# Altium schematic sheet Decawave.SchDoc
size A4
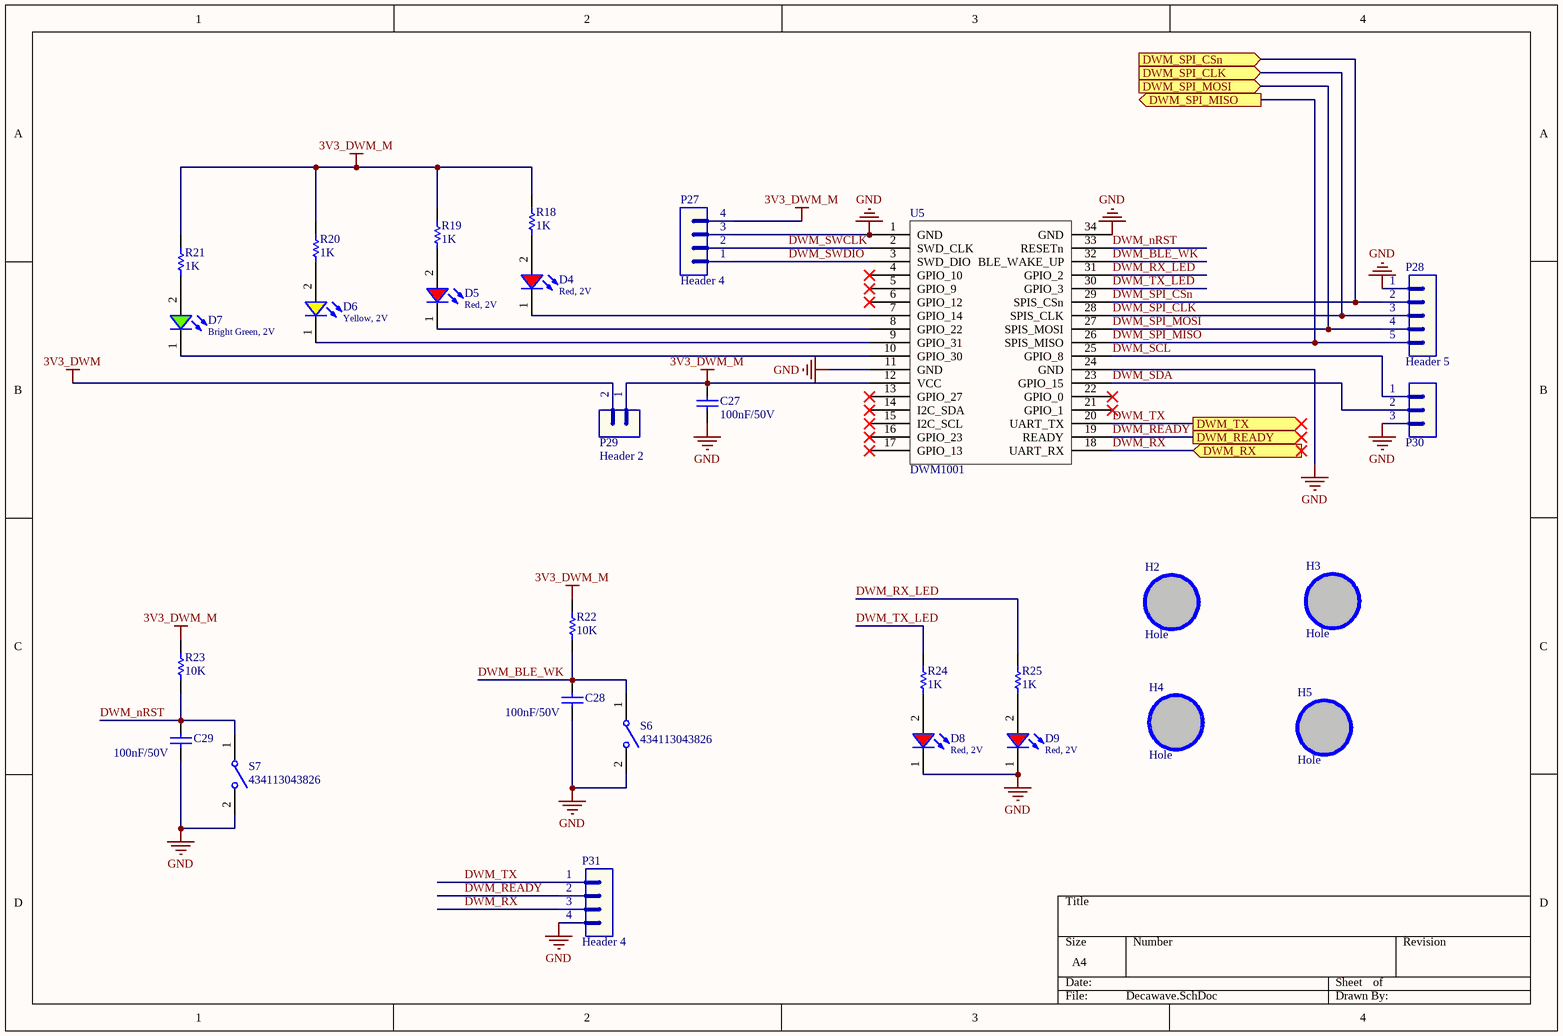
[diagram p0: Decawave.SchDoc]

## Parts
C27  value 100nF/50V  [CAP-SM-0805]  (hidden comment: Cap-100nF-50V-0805)
C28  value 100nF/50V  [CAP-SM-0805]  (hidden comment: Cap-100nF-50V-0805)
C29  value 100nF/50V  [CAP-SM-0805]  (hidden comment: Cap-100nF-50V-0805)
D4  Red, 2V  [WL-SMCW_0805]
D5  Red, 2V  [WL-SMCW_0805]
D6  Yellow, 2V  [WL-SMCW_0805]
D7  Bright Green, 2V  [WL-SMCW_0805]
D8  Red, 2V  [WL-SMCW_0805]
D9  Red, 2V  [WL-SMCW_0805]
H2  Hole  [LO KHOAN 3MM]
H3  Hole  [LO KHOAN 3MM]
H4  Hole  [LO KHOAN 3MM]
H5  Hole  [LO KHOAN 3MM]
P27  Header 4  [JP4]
P28  Header 5  [JP5]
P29  Header 2  [JP2]
P30  Header 3  [JP3]  (value not drawn)
P31  Header 4  [JP4]
R18  value 1K  [RES-SM-0805]  (hidden comment: Res-1K-0805)
R19  value 1K  [RES-SM-0805]  (hidden comment: Res-1K-0805)
R20  value 1K  [RES-SM-0805]  (hidden comment: Res-1K-0805)
R21  value 1K  [RES-SM-0805]  (hidden comment: Res-1K-0805)
R22  value 10K  [RES-SM-0805]  (hidden comment: Res-10k-0805)
R23  value 10K  [RES-SM-0805]  (hidden comment: Res-10k-0805)
R24  value 1K  [RES-SM-0805]  (hidden comment: Res-1K-0805)
R25  value 1K  [RES-SM-0805]  (hidden comment: Res-1K-0805)
S6  434113043826  [434113043826]
S7  434113043826  [434113043826]
U5  DWM1001  [DWM1001]

## Ports
DWM_READY (out), DWM_RX (in), DWM_SPI_CLK (in), DWM_SPI_CSn (in), DWM_SPI_MISO (out), DWM_SPI_MOSI (in), DWM_TX (out)

## Nets
3V3_DWM: P29.2
3V3_DWM_M: C27.2 P27.4 P29.1 R18.2 R19.2 R20.2 R21.2 R22.2 R23.2 U5.12(VCC)
GND: C27.1 C28.1 C29.1 D8.1(K) D9.1(K) P27.3 P28.1 P30.3 P31.4 S6.2 S7.2 U5.1(GND) U5.11(GND) U5.24(GND) U5.34(GND)
DWM_BLE_WK: C28.2 R22.1 S6.1 U5.32(BLE_WAKE_UP)
DWM_nRST: C29.2 R23.1 S7.1 U5.33(RESETn)
DWM_READY: P31.2 U5.19(READY) ; port DWM_READY
DWM_RX: P31.3 U5.18(UART_RX) ; port DWM_RX
DWM_RX_LED: R25.2 U5.31(GPIO_2)
DWM_SCL: P30.1 U5.25(GPIO_8)
DWM_SDA: P30.2 U5.23(GPIO_15)
DWM_SPI_CLK: P28.3 U5.28(SPIS_CLK) ; port DWM_SPI_CLK
DWM_SPI_CSn: P28.2 U5.29(SPIS_CSn) ; port DWM_SPI_CSn
DWM_SPI_MISO: P28.5 U5.26(SPIS_MISO) ; port DWM_SPI_MISO
DWM_SPI_MOSI: P28.4 U5.27(SPIS_MOSI) ; port DWM_SPI_MOSI
DWM_SWCLK: P27.2 U5.2(SWD_CLK)
DWM_SWDIO: P27.1 U5.3(SWD_DIO)
DWM_TX: P31.1 U5.20(UART_TX) ; port DWM_TX
DWM_TX_LED: R24.2 U5.30(GPIO_3)
NetD4_1: D4.1(K) U5.7(GPIO_14)
NetD4_2: D4.2(A) R18.1
NetD5_1: D5.1(K) U5.8(GPIO_22)
NetD5_2: D5.2(A) R19.1
NetD6_1: D6.1(K) U5.9(GPIO_31)
NetD6_2: D6.2(A) R20.1
NetD7_1: D7.1(K) U5.10(GPIO_30)
NetD7_2: D7.2(A) R21.1
NetD8_2: D8.2(A) R24.1
NetD9_2: D9.2(A) R25.1

Not connected (* = marked no-connect by the designer): H2 1; H3 1; H4 1; H5 1; U5 4(GPIO_10)* 5(GPIO_9)* 6(GPIO_12)* 13(GPIO_27)* 14(I2C_SDA)* 15(I2C_SCL)* 16(GPIO_23)* 17(GPIO_13)* 21(GPIO_1)* 22(GPIO_0)*

## Library data of the parts
C27-C29 = Cap-100nF-50V-0805: CAP CER 0.1UF 50V Y5V 0805; Manufacturer: Samsung Electro-Mechanics; Manufacturer Part Number: CL21F104ZBCNNNC; Local Supplier: thegioiic; Local Supplier Link: https://thegioiic.com/products/tu-100nf-0-1uf-50v-0805; Supplier 1: Digikey; Supplier 1 Part Number: 1276-1007-1-ND; Supplier 1 Link: https://www.digikey.com/product-detail/en/samsung-electro-mechanics/CL21F104ZBCNNNC/1276-1007-1-ND/3889093
D4 D5 D8 D9 = 150080RS75000: WL-SMCW SMT Mono-color Chip LED Waterclear, size 0805, Red, 2V, 140deg; Chip Technology: AlInGaP; Dominant Wavelength typ.: 625nm; Luminous Intensity typ.: 150mcd; Peak Wavelength typ.: 630nm; Viewing Angle: 140deg; ComponentLink1Description: Manufacturer; ComponentLink1URL: http://www.we-online.de; ComponentLink2URL: https://www.we-online.com/catalog/datasheet/150080RS75000.pdf; ComponentLink2Description: Datasheet; Forward Voltage typ.: 2V; Emitting Color: Red; Mounting Technology: SMT; Operating Temperature: -40 to +85degC; Published Date: December 2019; Part Number: 150080RS75000; Packaging: Tape and Reel; Size: 0805; Publisher: Wurth Elektronik
D6 = 150080YS75000: WL-SMCW SMT Mono-color Chip LED Waterclear, size 0805, Yellow, 2V, 140deg; Chip Technology: AlInGaP; Dominant Wavelength typ.: 590nm; Luminous Intensity typ.: 120mcd; Peak Wavelength typ.: 595nm; Viewing Angle: 140deg; ComponentLink1Description: Manufacturer; ComponentLink1URL: http://www.we-online.de; ComponentLink2URL: https://www.we-online.com/catalog/datasheet/150080YS75000.pdf; ComponentLink2Description: Datasheet; Forward Voltage typ.: 2V; Emitting Color: Yellow; Mounting Technology: SMT; Operating Temperature: -40 to +85degC; Published Date: December 2019; Part Number: 150080YS75000; Packaging: Tape and Reel; Size: 0805; Publisher: Wurth Elektronik
D7 = 150080VS75000: WL-SMCW SMT Mono-color Chip LED Waterclear, size 0805, Bright Green, 2V, 140deg; Chip Technology: AlInGaP; Dominant Wavelength typ.: 570nm; Luminous Intensity typ.: 40mcd; Peak Wavelength typ.: 572nm; Viewing Angle: 140deg; ComponentLink1Description: Manufacturer; ComponentLink1URL: http://www.we-online.de; ComponentLink2URL: https://www.we-online.com/catalog/datasheet/150080VS75000.pdf; ComponentLink2Description: Datasheet; Forward Voltage typ.: 2V; Emitting Color: Bright Green; Mounting Technology: SMT; Operating Temperature: -40 to +85degC; Published Date: December 2019; Part Number: 150080VS75000; Packaging: Tape and Reel; Size: 0805; Publisher: Wurth Elektronik
H2-H5 = Hole: Hole 3mm
P27 P31 = Header 4: Header, 4-Pin; LatestRevisionDate: 17-Jul-2002; LatestRevisionNote: Re-released for DXP Platform.; Publisher: Altium Limited
P28 = Header 5: Header, 5-Pin; LatestRevisionDate: 17-Jul-2002; LatestRevisionNote: Re-released for DXP Platform.; Publisher: Altium Limited
P29 = Header 2: Header, 2-Pin; LatestRevisionDate: 17-Jul-2002; LatestRevisionNote: Re-released for DXP Platform.; Publisher: Altium Limited
P30 = Header 3: Header, 3-Pin; LatestRevisionDate: 17-Jul-2002; LatestRevisionNote: Re-released for DXP Platform.; Publisher: Altium Limited
R18-R21 R24 R25 = Res-1K-0805: RES 1K OHM 1% 1/4W 0805; Manufacturer: Stackpole Electronics Inc; Manufacturer Part Number: RNCP0805FTD1K00; Local Supplier: thegioiic; Local Supplier Link: https://thegioiic.com/products/dien-tro-1k-ohm-0805-5; Supplier 1: Digikey; Supplier 1 Link: https://www.digikey.com/product-detail/en/stackpole-electronics-inc/RNCP0805FTD1K00/RNCP0805FTD1K00CT-ND/2240568; Supplier 1 Part Number: RNCP0805FTD1K00CT-ND
R22 R23 = Res-10k-0805: RES 10K OHM 1% 1/4W 0805; Manufacturer: Stackpole Electronics Inc; Manufacturer Part Number: RNCP0805FTD10K0; Local Supplier: thegioiic; Local Supplier Link: https://thegioiic.com/products/dien-tro-10k-ohm-0805-5; Supplier 1: Digikey; Supplier 1 Link: https://www.digikey.com/product-detail/en/stackpole-electronics-inc/RNCP0805FTD10K0/RNCP0805FTD10K0CT-ND/2240601; Supplier 1 Part Number: RNCP0805FTD10K0CT-ND
S6 S7 = 434113043826: WS-TASV J-Bend SMT Tact Switch 6x3.5mm, height 4.3mm, 260gf; Rated Voltage: 12VDC; Rated Current: 50mA; Washable: No; ComponentLink1Description: Manufacturer; ComponentLink1URL: http://www.we-online.de; ComponentLink2Description: Datasheet; ComponentLink2URL: https://katalog.we-online.com/em/datasheet/434113043826.pdf; Operating Temperature: -40 to +85degC; Part Number: 434113043826; Published Date: September 2019; Contact Material: Stainless Steel; Height: 4.3mm; Mounting Technology: SMT; Contact Plating: Silver; Operation Force: 260gf; Packaging: Tape and Reel; Terminal Material: Copper Alloy; Publisher: Wurth Elektronik; Terminal Plating: Silver
U5 = DWM1001: Local Supplier: *; Local Supplier Link: *; Local Supplier Part Number: *; Manufacturer: *; Manufacturer Part Number: *